# EAGLE design me433 (EAGLE 9.5.1)
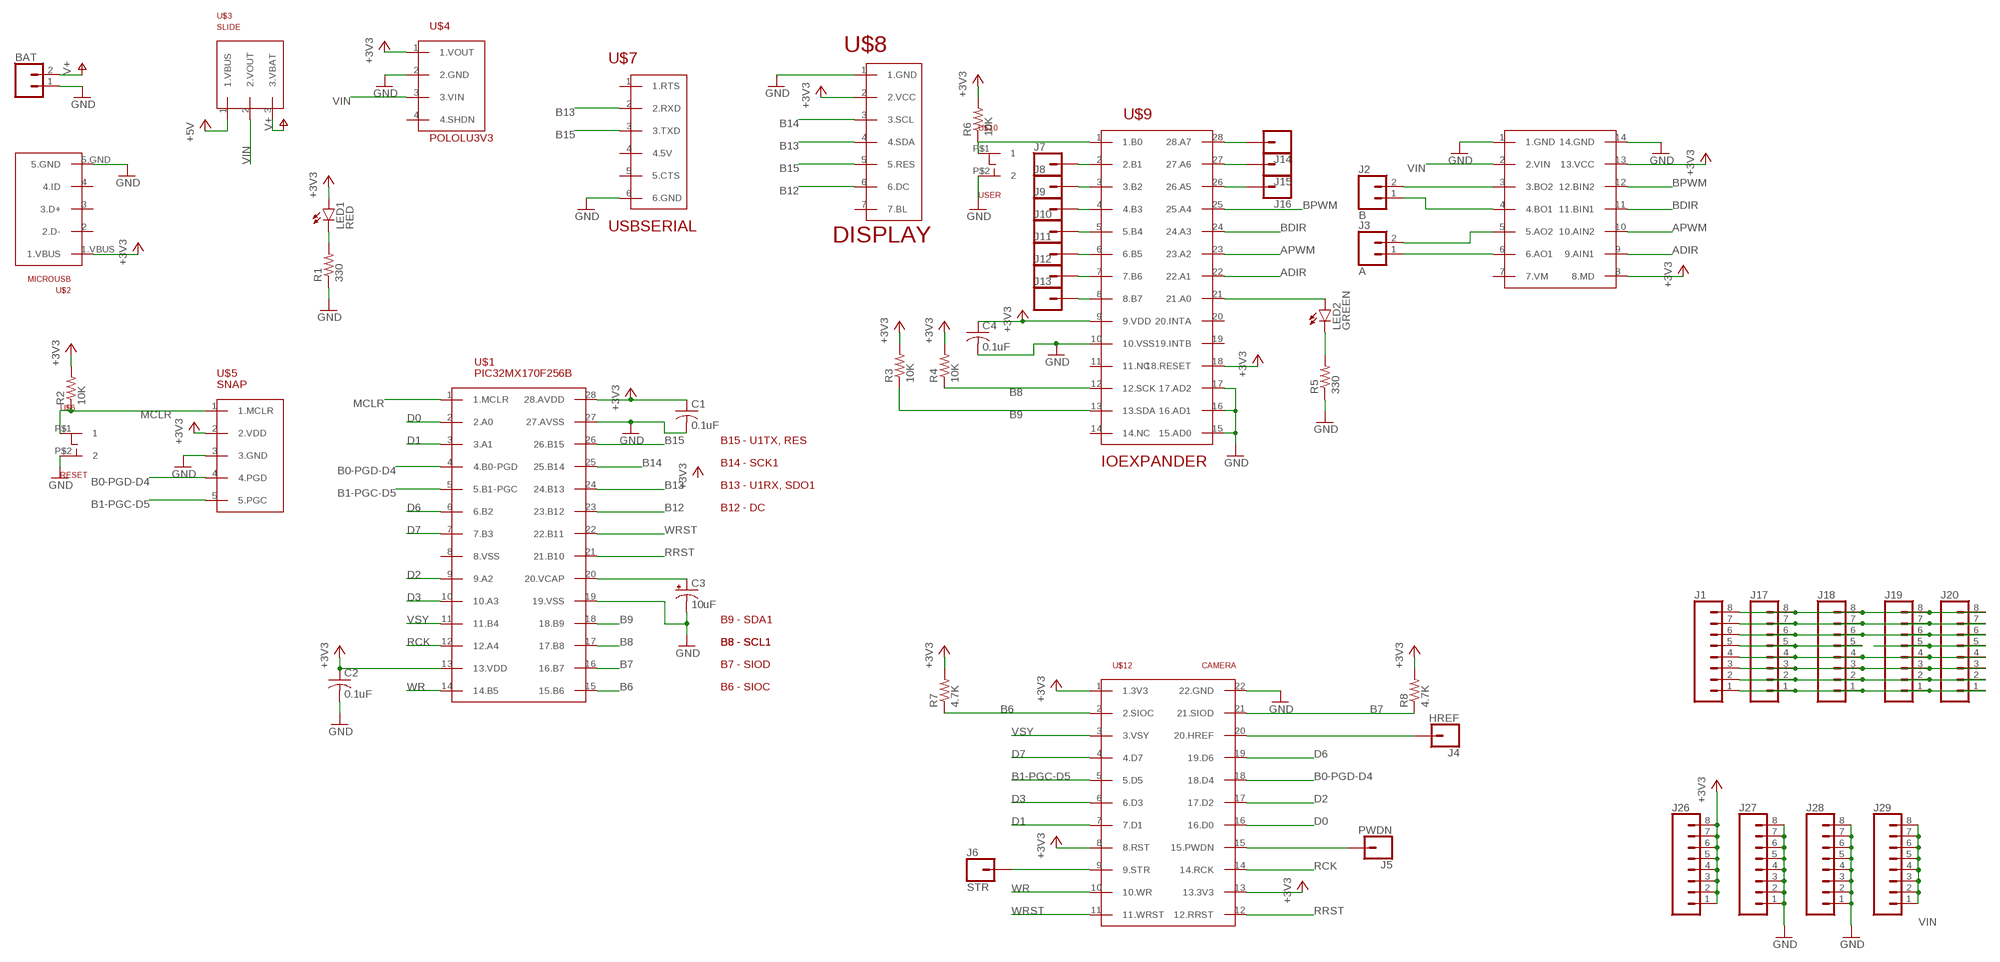
[diagram p0: schematic, sheet 1, part 1 of 2]
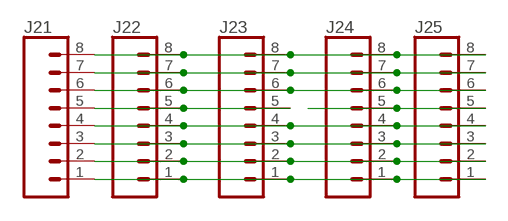
[diagram p1: schematic, sheet 1, part 2 of 2]

## Parts
BAT  CONN_02  [1X02]
C1  0.1uF  C-US025-030X050  [C025-030X050]
C2  0.1uF  C-US025-030X050  [C025-030X050]
C3  10uF  CPOL-USB45181B  [B45181B]
C4  0.1uF  C-US025-030X050  [C025-030X050]
J1  CONN_08"  [1X08]
J2  B  CONN_02  [1X02]
J3  A  CONN_02  [1X02]
J4  HREF  CONN_01  [1X01]
J5  PWDN  CONN_01  [1X01]
J6  STR  CONN_01  [1X01]
J7  CONN_01  [1X01]
J8  CONN_01  [1X01]
J9  CONN_01  [1X01]
J10  CONN_01  [1X01]
J11  CONN_01  [1X01]
J12  CONN_01  [1X01]
J13  CONN_01  [1X01]
J14  CONN_01  [1X01]
J15  CONN_01  [1X01]
J16  CONN_01  [1X01]
J17  CONN_08"  [1X08]
J18  CONN_08"  [1X08]
J19  CONN_08"  [1X08]
J20  CONN_08"  [1X08]
J21  CONN_08"  [1X08]
J22  CONN_08"  [1X08]
J23  CONN_08"  [1X08]
J24  CONN_08"  [1X08]
J25  CONN_08"  [1X08]
J26  CONN_08"  [1X08]
J27  CONN_08"  [1X08]
J28  CONN_08"  [1X08]
J29  CONN_08"  [1X08]
LED1  RED  LED3MM  [LED3MM]
LED2  GREEN  LED3MM  [LED3MM]
R1  330  R-US_0207/10  [0207/10]
R2  10K  R-US_0207/10  [0207/10]
R3  10K  R-US_0207/10  [0207/10]
R4  10K  R-US_0207/10  [0207/10]
R5  330  R-US_0207/10  [0207/10]
R6  10K  R-US_0207/10  [0207/10]
R7  4.7K  R-US_0207/10  [0207/10]
R8  4.7K  R-US_0207/10  [0207/10]
U$1  PIC32MX170F256B  [DIL28-3]
U$2  MICROUSB  [MICROUSB]
U$3  SLIDE  [SLIDE]
U$4  POLOLU3V3  [POLOLU3V3]
U$5  SNAP  [SNAP]
U$6  RESET  PUSH  [PUSH]
U$7  USBSERIAL  [USBSERIAL]
U$8  DISPLAY  [DISPLAY]
U$9  IOEXPANDER  [IOEXPANDER]
U$10  USER  PUSH  [PUSH]
U$11  HBRIDGE  [HBRIDGE]
U$12  CAMERA  [CAMERA]

## Nets
+3V1: LED2.A U$9.21(21.A0)
+3V3: C1.1 C2.1 C4.1 J26.1 J26.2 J26.3 J26.4 J26.5 J26.6 J26.7 J26.8 LED1.A R2.2 R3.2 R4.2 R6.2 R7.2 R8.2 U$1.13(13.VDD) U$1.28(28.AVDD) U$2.1.VBUS U$4.1(1.VOUT) U$5.2(2.VDD) U$8.2(2.VCC) U$9.9(9.VDD) U$9.18(18.RESET) U$11.8(8.MD) U$11.13(13.VCC) U$12.1(1.3V3) U$12.8(8.RST) U$12.13(13.3V3)
+5V: U$3.1(1.VBUS)
ADIR: U$9.22(22.A1) U$11.9(9.AIN1)
APWM: U$9.23(23.A2) U$11.10(10.AIN2)
B0-PGD-D4: U$1.4(4.B0-PGD) U$5.4(4.PGD) U$12.18(18.D4)
B1-PGC-D5: U$1.5(5.B1-PGC) U$5.5(5.PGC) U$12.5(5.D5)
B6: R7.1 U$1.15(15.B6) U$12.2(2.SIOC)
B7: R8.1 U$1.16(16.B7) U$12.21(21.SIOD)
B8: R4.1 U$1.17(17.B8) U$9.12(12.SCK)
B9: R3.1 U$1.18(18.B9) U$9.13(13.SDA)
B12: U$1.23(23.B12) U$8.6(6.DC)
B13: U$1.24(24.B13) U$7.2(2.RXD) U$8.4(4.SDA)
B14: U$1.25(25.B14) U$8.3(3.SCL)
B15: U$1.26(26.B15) U$7.3(3.TXD) U$8.5(5.RES)
BDIR: U$9.24(24.A3) U$11.11(11.BIN1)
BPWM: U$9.25(25.A4) U$11.12(12.BIN2)
D0: U$1.2(2.A0) U$12.16(16.D0)
D1: U$1.3(3.A1) U$12.7(7.D1)
D2: U$1.9(9.A2) U$12.17(17.D2)
D3: U$1.10(10.A3) U$12.6(6.D3)
D6: U$1.6(6.B2) U$12.19(19.D6)
D7: U$1.7(7.B3) U$12.4(4.D7)
GND: BAT.1 C1.2 C2.2 C3.- C4.2 J27.1 J27.2 J27.3 J27.4 J27.5 J27.6 J27.7 J27.8 J28.1 J28.2 J28.3 J28.4 J28.5 J28.6 J28.7 J28.8 R1.1 R5.1 U$1.19(19.VSS) U$1.27(27.AVSS) U$2.5.GND U$4.2(2.GND) U$5.3(3.GND) U$6.P$2 U$7.6(6.GND) U$8.1(1.GND) U$9.10(10.VSS) U$9.15(15.AD0) U$9.16(16.AD1) U$9.17(17.AD2) U$10.P$2 U$11.1(1.GND) U$11.14(14.GND) U$12.22(22.GND)
MCLR: R2.1 U$1.1(1.MCLR) U$5.1(1.MCLR) U$6.P$1
MCLR1: U$10.P$1
N$1: LED1.K(C) R1.2
N$2: C3.+ U$1.20(20.VCAP)
N$3: J2.2 U$11.3(3.BO2)
N$4: J2.1 U$11.4(4.BO1)
N$5: R6.1 U$9.1(1.B0)
N$6: LED2.K(C) R5.2
N$7: J3.2 U$11.5(5.AO2)
N$8: J3.1 U$11.6(6.AO1)
N$9: J4.1 U$12.20(20.HREF)
N$10: J5.1 U$12.15(15.PWDN)
N$11: J6.1 U$12.9(9.STR)
N$12: J14.1 U$9.28(28.A7)
N$13: J15.1 U$9.27(27.A6)
N$14: J16.1 U$9.26(26.A5)
N$15: J7.1 U$9.2(2.B1)
N$16: J8.1 U$9.3(3.B2)
N$17: J9.1 U$9.4(4.B3)
N$18: J10.1 U$9.5(5.B4)
N$19: J11.1 U$9.6(6.B5)
N$20: J12.1 U$9.7(7.B6)
N$21: J13.1 U$9.8(8.B7)
N$22: J1.8 J17.8 J18.8 J19.8 J20.8
N$23: J1.7 J17.7 J18.7 J19.7 J20.7
N$24: J1.6 J17.6 J18.6 J19.6 J20.6
N$25: J1.5 J17.5 J18.5
N$26: J19.5 J20.5
N$27: J1.4 J17.4 J18.4 J19.4 J20.4
N$28: J1.3 J17.3 J18.3 J19.3 J20.3
N$29: J1.2 J17.2 J18.2 J19.2 J20.2
N$30: J1.1 J17.1 J18.1 J19.1 J20.1
N$31: J21.8 J22.8 J23.8 J24.8 J25.8
N$32: J21.7 J22.7 J23.7 J24.7 J25.7
N$33: J21.6 J22.6 J23.6 J24.6 J25.6
N$34: J21.5 J22.5 J23.5
N$35: J24.5 J25.5
N$36: J21.4 J22.4 J23.4 J24.4 J25.4
N$37: J21.3 J22.3 J23.3 J24.3 J25.3
N$38: J21.2 J22.2 J23.2 J24.2 J25.2
N$39: J21.1 J22.1 J23.1 J24.1 J25.1
RCK: U$1.12(12.A4) U$12.14(14.RCK)
RRST: U$1.21(21.B10) U$12.12(12.RRST)
V+: BAT.2 U$3.3(3.VBAT)
VIN: J29.1 J29.2 J29.3 J29.4 J29.5 J29.6 J29.7 J29.8 U$3.2(2.VOUT) U$4.3(3.VIN) U$11.2(2.VIN)
VSY: U$1.11(11.B4) U$12.3(3.VSY)
WR: U$1.14(14.B5) U$12.10(10.WR)
WRST: U$1.22(22.B11) U$12.11(11.WRST)
Unconnected: U$1.8(8.VSS) U$2.2(2.D-) U$2.3(3.D+) U$2.4(4.ID) U$4.4(4.SHDN) U$7.1(1.RTS) U$7.4(4.5V) U$7.5(5.CTS) U$8.7(7.BL) U$9.11(11.NC) U$9.14(14.NC) U$9.19(19.INTB) U$9.20(20.INTA) U$11.7(7.VM)

## Notes on the sheet
- B15 - U1TX, RES
- B14 - SCK1
- B13 - U1RX, SDO1
- B12 - DC
- B9 - SDA1
- B8 - SCL1 | B8 - SCL1
- B7 - SIOD
- B6 - SIOC

## Library data of the parts
BAT J2 J3 = me433:CONN_02: Multi connection point. Often used as Generic Header-pin footprint for 0.1 inch spaced/style header connections On any of the 0.1 inch spaced packages, you can populate with these: Break Away Headers - Straight <https://www.sparkfun.com/products/116> (PRT-00116) Break Away Male Headers - Right Angle <https://www.sparkfun.com/products/553> (PRT-00553) Female Headers <https://www.sparkfun.com/products/115> (PRT-00115) Break Away Headers - Machine Pin <https://www.sparkfun.com/products/117> (PRT-00117) Break Away Female Headers - Swiss Machine Pin <https://www.sparkfun.com/products/743> (PRT-00743) For SCREWTERMINALS and SPRING TERMINALS visit here: Screw Terimnals on SparkFun.com <https://www.sparkfun.com/search/results?term=Screw+Terminals> (5mm/3.5mm/2.54mm spacing) This device is also useful as a general connection point to wire up your design to another part of your project. Our various solder wires solder well into these plated through hole pads. Hook-Up Wire - Assortment (Stranded, 22 AWG) <https://www.sparkfun.com/products/11375> (PRT-11375) Hook-Up Wire - Assortment (Solid Core, 22 AWG) <https://www.sparkfun.com/products/11367> (PRT-11367) View the entire wire category on our website here <https://www.sparkfun.com/categories/141> Special notes: Molex polarized connector foot print use with: PRT-08233 with associated crimp pins and housings. 2.54_SCREWTERM for use with PRT-10571. 3.5mm Screw Terminal footprints for PRT-08084 5mm Screw Terminal footprints for use with PRT-08432
C1 C2 C4 = me433:C-US: CAPACITOR, American symbol; SPICEPREFIX: C
C3 = me433:CPOL-US: POLARIZED CAPACITOR, American symbol; SPICEPREFIX: C
J1 J17-J29 = SparkFun-Connectors:CONN_08: Multi connection point. Often used as Generic Header-pin footprint for 0.1 inch spaced/style header connections On any of the 0.1 inch spaced packages, you can populate with these: Break Away Headers - Straight <https://www.sparkfun.com/products/116> (PRT-00116) Break Away Male Headers - Right Angle <https://www.sparkfun.com/products/553> (PRT-00553) Female Headers <https://www.sparkfun.com/products/115> (PRT-00115) Break Away Headers - Machine Pin <https://www.sparkfun.com/products/117> (PRT-00117) Break Away Female Headers - Swiss Machine Pin <https://www.sparkfun.com/products/743> (PRT-00743) Arduino Stackable Header - 8 Pin <https://www.sparkfun.com/products/9279> (PRT-09279) For SCREWTERMINALS and SPRING TERMINALS visit here: Screw Terimnals on SparkFun.com <https://www.sparkfun.com/search/results?term=Screw+Terminals> (5mm/3.5mm/2.54mm spacing) This device is also useful as a general connection point to wire up your design to another part of your project. Our various solder wires solder well into these plated through hole pads. Hook-Up Wire - Assortment (Stranded, 22 AWG) <https://www.sparkfun.com/products/11375> (PRT-11375) Hook-Up Wire - Assortment (Solid Core, 22 AWG) <https://www.sparkfun.com/products/11367> (PRT-11367) View the entire wire category on our website here <https://www.sparkfun.com/categories/141> Special notes: Molex polarized connector foot print use with SKU : PRT-08231 with associated crimp pins and housings. 1MM SMD Version SKU: PRT-10208 NOTES ON THE VARIANTS LOCK and LOCK_LONGPADS... This footprint was designed to help hold the alignment of a through-hole component (i.e. 6-pin header) while soldering it into place. You may notice that each hole has been shifted either up or down by 0.005 of an inch from it's more standard position (which is a perfectly straight line). This slight alteration caused the pins (the squares in the middle) to touch the edges of the holes. Because they are alternating, it causes a "brace" to hold the component in place. 0.005 has proven to be the perfect amount of "off-center" position when using our standard breakaway headers. Although looks a little odd when you look at the bare footprint, once you have a header in there, the alteration is very hard to notice. Also,if you push a header all the way into place, it is covered up entirely on the bottom side.; PROD_ID: CONN-08438
J4-J16 = me433:CONN_01: Single connection point. Often used as Generic Header-pin footprint for 0.1 inch spaced/style header connections On any of the 0.1 inch spaced packages, you can populate with these: Break Away Headers - Straight <https://www.sparkfun.com/products/116> (PRT-00116) Break Away Male Headers - Right Angle <https://www.sparkfun.com/products/553> (PRT-00553) Female Headers <https://www.sparkfun.com/products/115> (PRT-00115) Break Away Headers - Machine Pin <https://www.sparkfun.com/products/117> (PRT-00117) Break Away Female Headers - Swiss Machine Pin <https://www.sparkfun.com/products/743> (PRT-00743) This device is also useful as a general connection point to wire up your design to another part of your project. Our various solder wires solder well into these plated through hole pads. Hook-Up Wire - Assortment (Stranded, 22 AWG) <https://www.sparkfun.com/products/11375> (PRT-11375) Hook-Up Wire - Assortment (Solid Core, 22 AWG) <https://www.sparkfun.com/products/11367> (PRT-11367) View the entire wire category on our website here <https://www.sparkfun.com/categories/141> Special notes: SMTSO-256-ET is a "flush mount" nut for a 4-40 screw. We mostly use this on specialty testbeds; it is a nice way to connect hardware to your PCB at an adjustable hieght. Also note, the SNAP packages are for using a snappable style connector. We sell a baggie of snaps and they are also used on two LilyPad designs: Snap Assortment - 30 pack (male and female) <https://www.sparkfun.com/products/11347> (DEV-11347) LilyPad Arduino SimpleSnap <https://www.sparkfun.com/products/10941> (DEV-10941) LilyPad SimpleSnap Protoboard <https://www.sparkfun.com/products/10940> (DEV-10940)
LED1 LED2 = me433:LED: LED OSRAM: - CHIPLED LG R971, LG N971, LY N971, LG Q971, LY Q971, LO R971, LY R971 LH N974, LH R974 LS Q976, LO Q976, LY Q976 LO Q996 - Hyper CHIPLED LW Q18S LB Q993, LB Q99A, LB R99A - SideLED LS A670, LO A670, LY A670, LG A670, LP A670 LB A673, LV A673, LT A673, LW A673 LH A674 LY A675 LS A676, LA A676, LO A676, LY A676, LW A676 LS A679, LY A679, LG A679 - Hyper Micro SIDELED® LS Y876, LA Y876, LO Y876, LY Y876 LT Y87S - SmartLED LW L88C, LW L88S LB L89C, LB L89S, LG L890 LS L89K, LO L89K, LY L89K LS L896, LA L896, LO L896, LY L896 - TOPLED LS T670, LO T670, LY T670, LG T670, LP T670 LSG T670, LSP T670, LSY T670, LOP T670, LYG T670 LG T671, LOG T671, LSG T671 LB T673, LV T673, LT T673, LW T673 LH T674 LS T676, LA T676, LO T676, LY T676, LB T676, LH T676, LSB T676, LW T676 LB T67C, LV T67C, LT T67C, LS T67K, LO T67K, LY T67K, LW E67C LS E67B, LA E67B, LO E67B, LY E67B, LB E67C, LV E67C, LT E67C LW T67C LS T679, LY T679, LG T679 LS T770, LO T770, LY T770, LG T770, LP T770 LB T773, LV T773, LT T773, LW T773 LH T774 LS E675, LA E675, LY E675, LS T675 LS T776, LA T776, LO T776, LY T776, LB T776 LHGB T686 LT T68C, LB T68C - Hyper Mini TOPLED® LB M676 - Mini TOPLED Santana® LG M470 LS M47K, LO M47K, LY M47K Source: http://www.osram.convergy.de LUXEON: - LUMILED® LXK2-PW12-R00, LXK2-PW12-S00, LXK2-PW14-U00, LXK2-PW14-V00 LXK2-PM12-R00, LXK2-PM12-S00, LXK2-PM14-U00 LXK2-PE12-Q00, LXK2-PE12-R00, LXK2-PE12-S00, LXK2-PE14-T00, LXK2-PE14-U00 LXK2-PB12-K00, LXK2-PB12-L00, LXK2-PB12-M00, LXK2-PB14-N00, LXK2-PB14-P00, LXK2-PB14-Q00 LXK2-PR12-L00, LXK2-PR12-M00, LXK2-PR14-Q00, LXK2-PR14-R00 LXK2-PD12-Q00, LXK2-PD12-R00, LXK2-PD12-S00 LXK2-PH12-R00, LXK2-PH12-S00 LXK2-PL12-P00, LXK2-PL12-Q00, LXK2-PL12-R00 Source: www.luxeon.com KINGBRIGHT: KA-3528ASYC Source: www.kingbright.com
R1-R8 = me433:R-US_: RESISTOR, American symbol; SPICEPREFIX: R
U$1 = me433:PIC32MX170F256B
U$2 = me433:MICROUSB
U$3 = me433:SLIDE
U$4 = me433:POLOLU3V3
U$5 = me433:SNAP
U$6 U$10 = me433:PUSH
U$7 = me433:USBSERIAL
U$8 = me433:DISPLAY
U$9 = me433:IOEXPANDER
U$11 = me433:HBRIDGE
U$12 = me433:CAMERA

## Board
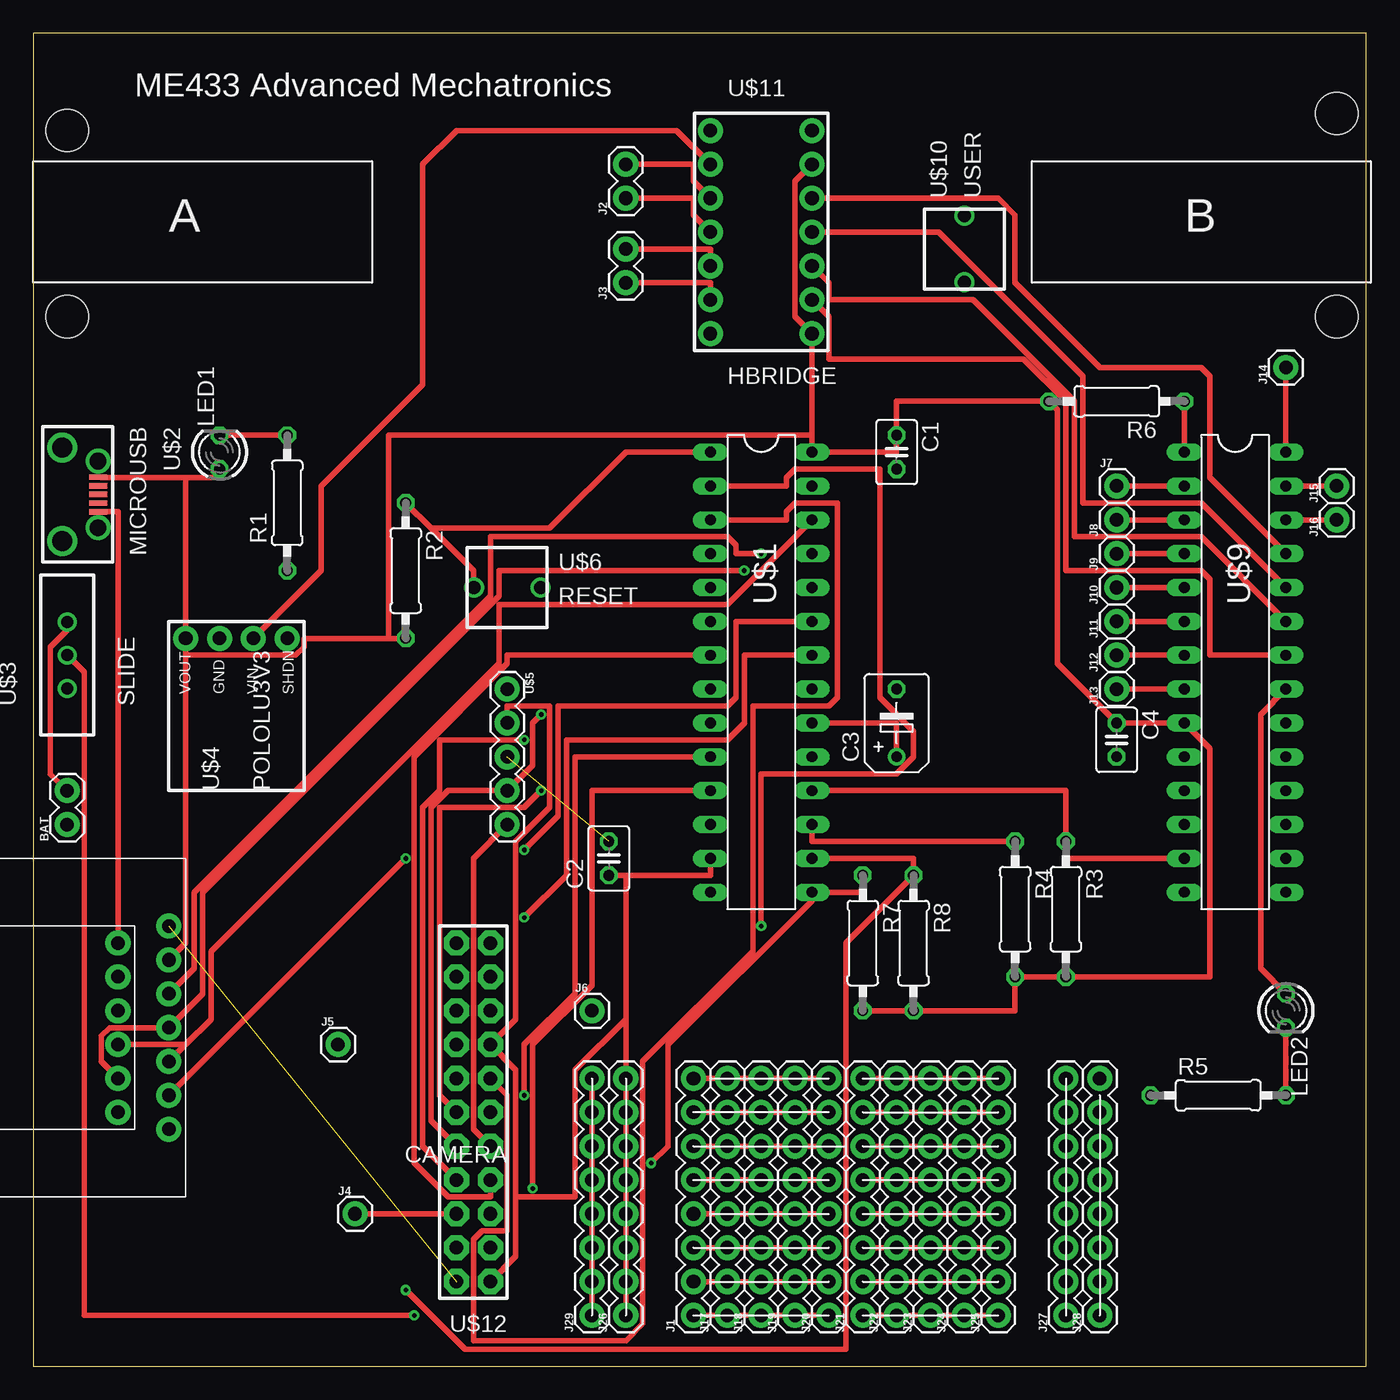
[diagram p2: board, top side]
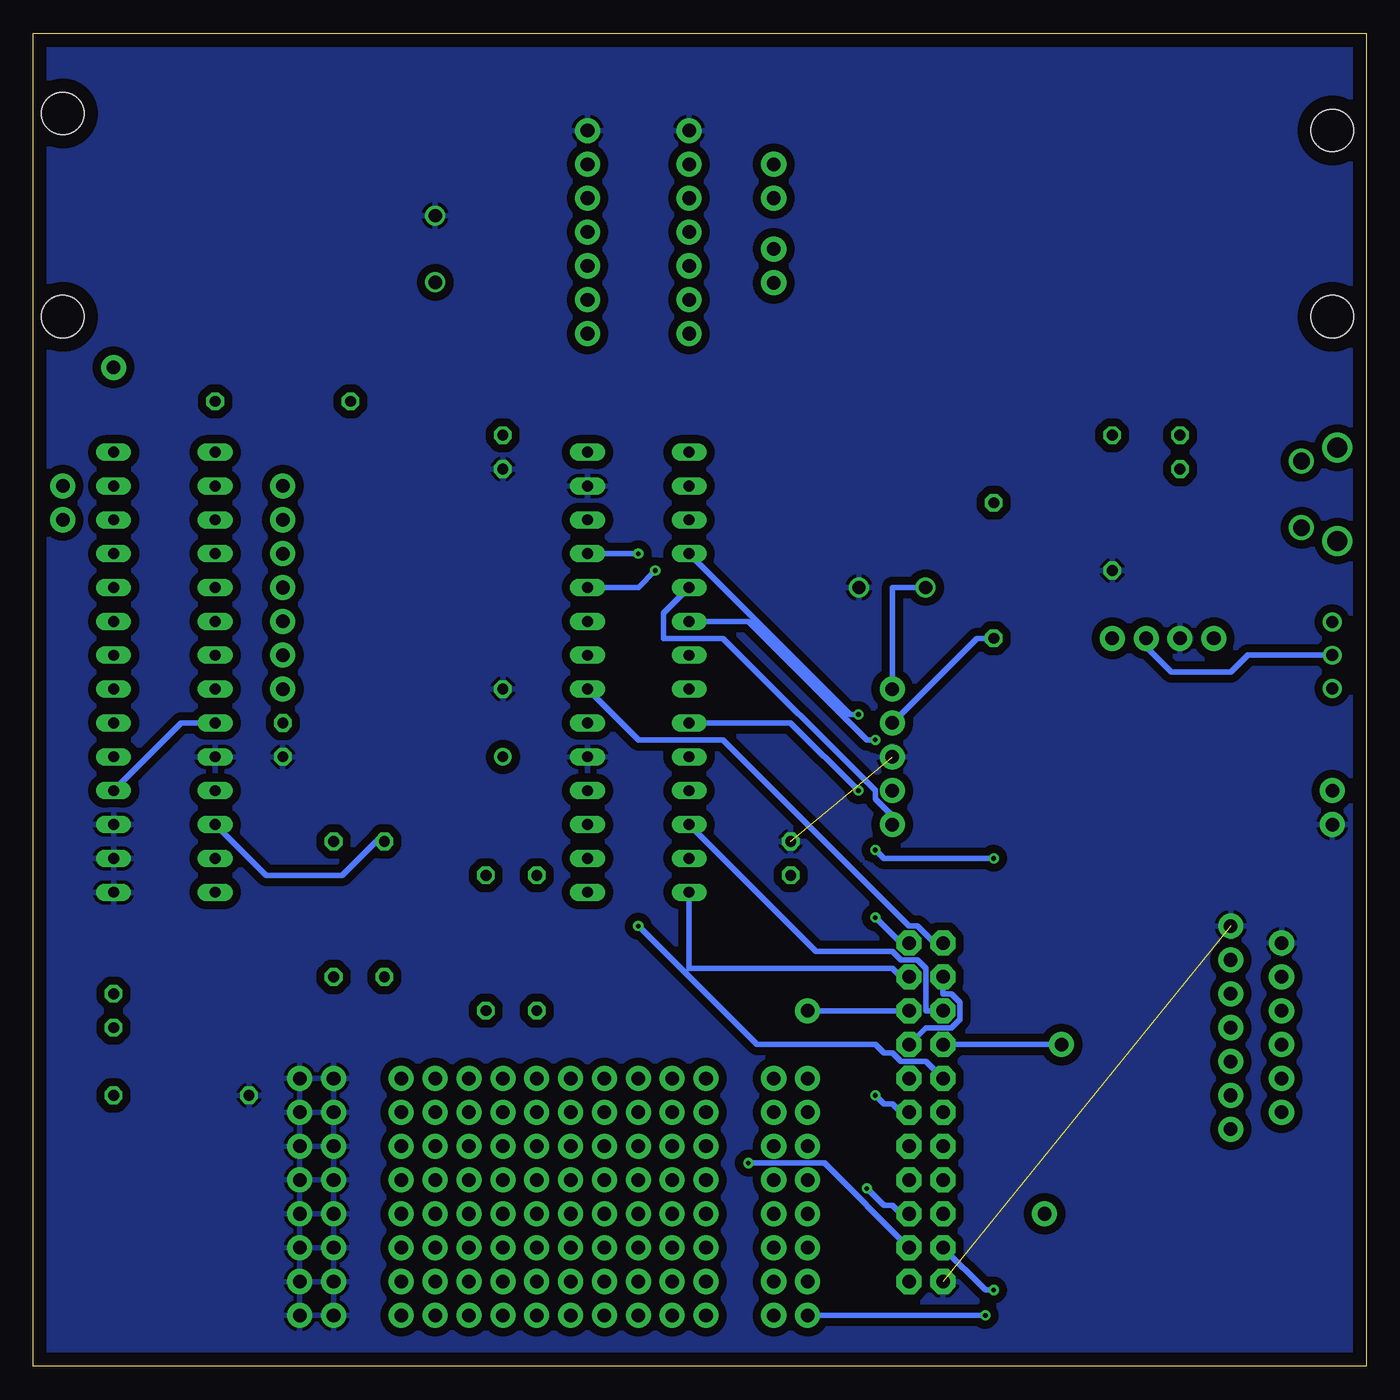
[diagram p3: board, bottom side, seen from below]

Size 100 x 100 mm. Coordinates in mm from the lower left corner, seen from the top.
Outline: 0,0 100,0 100,100 0,100 0,0
Copper layers (1*16): Top 0.035mm / dielectric 1.5mm / Bottom 0.035mm
Design rules "default": minimum track width 6mil, minimum drill 0.35mm, track to track 6mil, track to pad 6mil, pad to pad 6mil, via to via 6mil, smd to smd 6mil, copper to edge 40mil, drill to drill 6mil, minimum pad ring 10mil, minimum via ring 8mil, stop-mask expansion 4mil, vias tented up to drill 0mil, thermal gap 10mil
Holes 3.17 mm at 2.54,92.71 2.54,78.74 97.79,93.98 97.79,78.74

### Footprints (pad centres in the part's own frame; a part is rotated, then mirrored left to right if it is on the bottom)
1X02 = drill 1.016 pad 1.88: 1 0,0; 2 2.54,0
C025-030X050 = drill 0.813 octagon: 1 -1.27,0; 2 1.27,0
B45181B = drill 0.813: + -2.54,0 | drill 0.813 octagon: - 2.54,0
1X08 = drill 1.016 pad 1.88: 1 0,0; 2 2.54,0; 3 5.08,0; 4 7.62,0; 5 10.16,0; 6 12.7,0; 7 15.24,0; 8 17.78,0
1X01 = drill 1.016 pad 1.88: 1 0,0
LED3MM = drill 0.813 octagon: A -1.27,0; K 1.27,0
0207/10 = drill 0.813 octagon: 1 -5.08,0; 2 5.08,0
DIL28-3 = drill 0.813 long: 1 -16.51,-3.81; 2 -13.97,-3.81; 3 -11.43,-3.81; 4 -8.89,-3.81; 5 -6.35,-3.81; 6 -3.81,-3.81; 7 -1.27,-3.81; 8 1.27,-3.81; 9 3.81,-3.81; 10 6.35,-3.81; 11 8.89,-3.81; 12 11.43,-3.81; 13 13.97,-3.81; 14 16.51,-3.81; 15 16.51,3.81; 16 13.97,3.81; 17 11.43,3.81; 18 8.89,3.81; 19 6.35,3.81; 20 3.81,3.81; 21 1.27,3.81; 22 -1.27,3.81; 23 -3.81,3.81; 24 -6.35,3.81; 25 -8.89,3.81; 26 -11.43,3.81; 27 -13.97,3.81; 28 -16.51,3.81
MICROUSB = smd 0.4 x 1.35: 1.VBUS -1.3,2.7; 2 -0.65,2.7; 3 0,2.7; 4 0.65,2.7; 5.GND 1.3,2.7 | drill 1.25 pad 1.676: P$6 -2.5,2.7; P$7 2.5,2.7 | drill 1.5: P$8 -3.5,0; P$9 3.5,0
SLIDE = drill 0.9: 1 -2.5,0; 2 0,0; 3 2.5,0
POLOLU3V3 = drill 1.016 pad 1.88: 1 0,3.81; 2 0,1.27; 3 0,-1.27; 4 0,-3.81
SNAP = drill 1.016 pad 1.88: 1 0,5.08; 2 0,2.54; 3 0,0; 4 0,-2.54; 5 0,-5.08
PUSH = drill 1: P$1 -2.5,0; P$2 2.5,0
USBSERIAL = drill 1.016 pad 1.88: 1 0,6.35; 2 0,3.81; 3 0,1.27; 4 0,-1.27; 5 0,-3.81; 6 0,-6.35
DISPLAY = drill 1.016 pad 1.88: 1 -1.27,7.62; 2 -1.27,5.08; 3 -1.27,2.54; 4 -1.27,0; 5 -1.27,-2.54; 6 -1.27,-5.08; 7 -1.27,-7.62
IOEXPANDER = drill 0.813 long: 1 -16.51,-3.81; 2 -13.97,-3.81; 3 -11.43,-3.81; 4 -8.89,-3.81; 5 -6.35,-3.81; 6 -3.81,-3.81; 7 -1.27,-3.81; 8 1.27,-3.81; 9 3.81,-3.81; 10 6.35,-3.81; 11 8.89,-3.81; 12 11.43,-3.81; 13 13.97,-3.81; 14 16.51,-3.81; 15 16.51,3.81; 16 13.97,3.81; 17 11.43,3.81; 18 8.89,3.81; 19 6.35,3.81; 20 3.81,3.81; 21 1.27,3.81; 22 -1.27,3.81; 23 -3.81,3.81; 24 -6.35,3.81; 25 -8.89,3.81; 26 -11.43,3.81; 27 -13.97,3.81; 28 -16.51,3.81
HBRIDGE = drill 1.016 pad 1.88: 1 -3.81,7.62; 2 -3.81,5.08; 3 -3.81,2.54; 4 -3.81,0; 5 -3.81,-2.54; 6 -3.81,-5.08; 7 -3.81,-7.62; 8 3.81,-7.62; 9 3.81,-5.08; 10 3.81,-2.54; 11 3.81,0; 12 3.81,2.54; 13 3.81,5.08; 14 3.81,7.62
CAMERA = drill 1.016 pad 1.88 octagon: 1 -1.27,12.7; 2 -1.27,10.16; 3 -1.27,7.62; 4 -1.27,5.08; 5 -1.27,2.54; 6 -1.27,0; 7 -1.27,-2.54; 8 -1.27,-5.08; 9 -1.27,-7.62; 10 -1.27,-10.16; 11 -1.27,-12.7; 12 1.27,-12.7; 13 1.27,-10.16; 14 1.27,-7.62; 15 1.27,-5.08; 16 1.27,-2.54; 17 1.27,0; 18 1.27,2.54; 19 1.27,5.08; 20 1.27,7.62; 21 1.27,10.16; 22 1.27,12.7

### Placement (x,y rotation side)
BAT  2.54,40.64 90 top
C1  64.77,68.58 270 top
C2  43.18,38.1 90 top
C3  64.77,48.26 90 top
C4  81.28,46.99 270 top
J1  49.53,3.81 90 top
J2  44.45,87.63 90 top
J3  44.45,81.28 90 top
J4  24.13,11.43 0 top
J5  22.86,24.13 0 top
J6  41.91,26.67 0 top
J7  81.28,66.04 0 top
J8  81.28,63.5 90 top
J9  81.28,60.96 90 top
J10  81.28,58.42 90 top
J11  81.28,55.88 90 top
J12  81.28,53.34 90 top
J13  81.28,50.8 90 top
J14  93.98,74.93 90 top
J15  97.79,66.04 90 top
J16  97.79,63.5 90 top
J17  52.07,3.81 90 top
J18  54.61,3.81 90 top
J19  57.15,3.81 90 top
J20  59.69,3.81 90 top
J21  62.23,3.81 90 top
J22  64.77,3.81 90 top
J23  67.31,3.81 90 top
J24  69.85,3.81 90 top
J25  72.39,3.81 90 top
J26  44.45,3.81 90 top
J27  77.47,3.81 90 top
J28  80.01,3.81 90 top
J29  41.91,3.81 90 top
LED1  13.97,68.58 90 top
LED2  93.98,26.67 270 top
R1  19.05,64.77 90 top
R2  27.94,59.69 270 top
R3  77.47,34.29 270 top
R4  73.66,34.29 270 top
R5  88.9,20.32 0 top
R6  81.28,72.39 180 top
R7  62.23,31.75 270 top
R8  66.04,31.75 270 top
U$1  54.61,52.07 270 top
U$2  2.16,65.41 270 top
U$3  2.54,53.34 90 top
U$4  15.24,54.61 90 top
U$5  35.56,45.72 0 top
U$6  35.56,58.42 0 top
U$7  6.35,25.4 180 top
U$8  11.43,25.4 0 top
U$9  90.17,52.07 270 top
U$10  69.85,83.82 90 top
U$11  54.61,85.09 0 top
U$12  33.02,19.05 180 top

### Tracks (layer width: path | path; a pad name or v marks a point on that pad's centre or on a via)
+3V1
  Top 0.406: LED2.A 92.08,29.84 92.08,48.9 U$9.21
+3V3
  Top 0.406: 58.42,69.85 U$1.28 64.77,68.58 C1.1 64.77,72.39 R6.2 76.83,71.75 76.83,52.7 C4.1 U$9.9 88.27,46.35 88.27,29.21 R3.2 R4.2 73.66,26.67 R8.2 R7.2 | 58.42,69.85 U$11.8 57.15,78.74 57.15,88.9 U$11.13 | U$12.1 36.2,8.26 36.2,12.7 | 36.2,12.7 36.2,22.23 U$12.8 36.2,26.04 36.2,39.37 38.73,41.91 38.73,49.53 35.56,49.53 U$5.2 | 44.45,36.83 50.8,36.83 U$1.13 | 44.45,36.83 C2.1 | J26.1 J26.2 J26.3 J26.4 J26.5 J26.6 J26.7 J26.8 44.45,26.04 | 44.45,26.04 44.45,36.83 | 36.2,12.7 40.64,12.7 40.64,22.23 44.45,26.04 | 11.43,66.67 13.97,66.67 LED1.A | 11.43,66.67 5.08,66.67 U$2.1.VBUS | 26.67,54.61 20.32,54.61 20.32,53.98 19.68,53.34 11.43,53.34 | 26.67,54.61 R2.2 | 11.43,53.34 U$4.1 11.43,66.67 | U$8.2 11.43,31.75 11.43,53.34 | 58.42,69.85 26.67,69.85 26.67,54.61
  Bottom 0.406: U$9.18 88.9,48.26 U$9.9 | U$12.13 31.75,27.94 31.11,27.94 30.48,27.3 30.48,26.04 31.11,25.4 33.02,25.4 U$12.8 | U$5.2 29.21,54.61 R2.2
ADIR
  Top 0.406: U$9.22 88.27,53.34 88.27,59.05 87.63,59.69 77.47,59.69 77.47,72.39 74.3,75.56 59.69,75.56 59.69,78.74 U$11.9
APWM
  Top 0.406: U$9.23 87.63,62.23 78.11,62.23 78.11,72.39 70.48,80.01 59.69,80.01 59.69,81.28 U$11.10
B0-PGD-D4  (via drill 0.35)
  Top 0.406: v38.1,48.9 37.47,48.26 37.47,45.09 U$5.4 31.11,43.18 29.84,41.91 29.84,18.41 U$12.18
  Bottom 0.406: U$1.4 38.73,48.9 v38.1,48.9
B1-PGC-D5
  Top 0.406: U$12.5 33.02,17.78 33.02,38.1 U$5.5
  Bottom 0.406: U$1.5 52.7,56.52 52.7,54.61 48.26,54.61 36.83,43.18 36.83,42.55 35.56,41.27 U$5.5
B6  (via drill 0.35)
  Top 0.406: R7.1 62.23,35.56 U$1.15 58.42,34.92 47.62,24.13 47.62,16.51 v46.35,15.24
  Bottom 0.406: U$12.2 40.64,15.24 v46.35,15.24
B7  (via drill 0.35)
  Top 0.406: U$1.16 66.04,38.1 R8.1 60.96,31.75 60.96,1.27 32.38,1.27 v27.94,5.71
  Bottom 0.406: U$12.21 28.57,5.71 v27.94,5.71
B8
  Top 0.406: R4.1 58.42,39.37 U$1.17
  Bottom 0.406: U$9.12 82.55,36.83 76.83,36.83 74.3,39.37 R4.1
B9
  Top 0.406: U$1.18 77.47,43.18 R3.1 77.47,38.1 U$9.13
B12  (via drill 0.35)
  Top 0.406: U$1.23 52.7,55.88 52.7,50.16 52.07,49.53 39.37,49.53 39.37,41.27 v36.83,38.73 | U$8.6 v27.94,38.1
  Bottom 0.406: v36.83,38.73 36.2,38.1 v27.94,38.1
B13  (via drill 0.35)
  Top 0.406: v53.34,59.69 34.92,59.69 34.92,57.78 12.7,35.56 12.7,27.94 U$8.4 5.71,25.4 5.08,24.77 5.08,22.86 U$7.2
  Bottom 0.406: U$1.24 54.61,58.42 v53.34,59.69
B14  (via drill 0.35)
  Top 0.406: v54.61,60.96 52.7,60.96 52.7,61.59 52.07,62.23 34.29,62.23 34.29,57.78 12.06,35.56 12.06,29.84 U$8.3
  Bottom 0.406: v54.61,60.96 U$1.25
B15
  Top 0.406: U$1.26 52.07,57.15 34.92,57.15 34.92,52.7 13.34,31.11 13.34,26.04 11.43,24.13 | U$8.5 11.43,24.13 | 11.43,24.13 U$7.3
BDIR
  Top 0.406: U$9.24 87.63,64.77 78.74,64.77 78.74,74.3 67.94,85.09 U$11.11
BPWM
  Top 0.406: U$9.25 88.27,66.67 88.27,74.3 87.63,74.93 80.01,74.93 73.66,81.28 73.66,86.36 72.39,87.63 U$11.12
D0  (via drill 0.35)
  Top 0.406: U$1.2 56.52,66.04 56.52,66.67 57.15,67.31 63.5,67.31 63.5,50.16 66.04,47.62 66.04,45.72 64.77,44.45 54.61,44.45 v54.61,33.02
  Bottom 0.406: v54.61,33.02 45.72,24.13 36.83,24.13 36.2,23.5 35.56,23.5 34.92,22.86 33.02,22.86 U$12.16
D1
  Top 0.406: U$1.3 56.52,63.5 56.52,64.14 57.15,64.77 60.33,64.77 60.33,50.16 59.69,49.53 53.98,49.53 53.98,31.11 45.72,22.86 45.72,3.17 44.45,1.91 33.02,1.91 33.02,9.53 33.66,10.16 35.56,10.16 35.56,20.32 U$12.7
D2  (via drill 0.35)
  Top 0.406: v38.1,43.18 36.83,41.91 30.48,41.91 30.48,20.32 U$12.17
  Bottom 0.406: U$1.9 43.18,48.26 v38.1,43.18
D3  (via drill 0.35)
  Top 0.406: U$1.10 40.64,45.72 40.64,27.94 36.83,24.13 v36.83,20.32
  Bottom 0.406: v36.83,20.32 36.2,19.68 35.56,19.68 34.92,19.05 U$12.6
D6  (via drill 0.35)
  Top 0.406: v36.83,46.99 30.48,46.99 30.48,43.18 29.21,41.91 29.21,16.51 U$12.19
  Bottom 0.406: U$1.6 46.35,55.88 37.47,46.99 v36.83,46.99
D7
  Top 0.406: U$1.7 35.56,53.34 35.56,52.7 28.57,45.72 28.57,15.24 31.11,12.7 34.29,12.7 U$12.4
GND  (2 unrouted)
  Top 0.406: U$7.6 6.35,64.14 5.08,64.14 U$2.5.GND
  Bottom 0.152: 80.01,19.68 J28.7 | J28.8 79.96,21.54
  pour Bottom (isolate 0.61): 0,100.33 0,0 100.33,0 100.33,100.33
MCLR
  Top 0.406: 29.84,62.87 33.02,59.69 33.02,58.42 U$6.P$1 | 29.84,62.87 R2.1 | U$1.1 44.45,68.58 38.73,62.87 29.84,62.87
  Bottom 0.406: U$5.1 35.56,58.42 U$6.P$1
N$1
  Top 0.406: R1.2 LED1.K
N$2
  Top 0.406: U$1.20 64.77,48.26 C3.+
N$3
  Top 0.406: J2.2 49.53,90.17 49.53,88.9 U$11.3
N$4
  Top 0.406: J2.1 49.53,87.63 49.53,86.36 U$11.4
N$5
  Top 0.406: R6.1 U$9.1
N$6
  Top 0.406: LED2.K R5.2
N$7
  Top 0.406: J3.2 50.8,83.82 U$11.5
N$8
  Top 0.406: J3.1 50.8,81.28 U$11.6
N$9
  Top 0.406: U$12.20 J4.1
N$10
  Bottom 0.406: U$12.15 J5.1
N$11
  Bottom 0.406: J6.1 U$12.9
N$12
  Top 0.406: J14.1 U$9.28
N$13
  Top 0.406: J15.1 U$9.27
N$14
  Top 0.406: J16.1 U$9.26
N$15
  Top 0.406: J7.1 U$9.2
N$16
  Top 0.406: J8.1 U$9.3
N$17
  Top 0.406: J9.1 U$9.4
N$18
  Top 0.406: J10.1 U$9.5
N$19
  Top 0.406: J11.1 U$9.6
N$20
  Top 0.406: J12.1 U$9.7
N$21
  Top 0.406: J13.1 U$9.8
N$22
  Top 0.406: J1.8 J17.8 J18.8 J19.8 J20.8
N$23
  Top 0.406: J1.7 J17.7 J18.7 J19.7 J20.7
N$24
  Top 0.406: J1.6 J17.6 J18.6 J19.6 J20.6
N$25
  Top 0.406: J1.5 J17.5 J18.5
N$26
  Top 0.406: J20.5 J19.5
N$27
  Top 0.406: J1.4 J17.4 J18.4 J19.4 J20.4
N$28
  Top 0.406: J1.3 J17.3 J18.3 J19.3 J20.3
N$29
  Top 0.406: J1.2 J17.2 J18.2 J19.2 J20.2
N$30
  Top 0.406: J1.1 J17.1 J18.1 J19.1 J20.1
N$31
  Top 0.406: J21.8 J22.8 J23.8 J24.8 J25.8
N$32
  Top 0.406: J21.7 J22.7 J23.7 J24.7 J25.7
N$33
  Top 0.406: J21.6 J22.6 J23.6 J24.6 J25.6
N$34
  Top 0.406: J21.5 J22.5 J23.5
N$35
  Top 0.406: J25.5 J24.5
N$36
  Top 0.406: J21.4 J22.4 J23.4 J24.4 J25.4
N$37
  Top 0.406: J21.3 J22.3 J23.3 J24.3 J25.3
N$38
  Top 0.406: J21.2 J22.2 J23.2 J24.2 J25.2
N$39
  Top 0.406: J21.1 J22.1 J23.1 J24.1 J25.1
RCK
  Bottom 0.406: U$1.12 41.27,31.11 35.56,31.11 34.92,30.48 33.66,30.48 33.02,29.84 33.02,26.67 U$12.14
RRST
  Bottom 0.406: U$1.21 54.61,46.99 48.26,46.99 34.29,33.02 33.66,33.02 32.38,31.75 U$12.12
V+
  Top 0.406: BAT.2 1.27,44.45 1.27,53.98 2.54,55.24 U$3.3
VIN  (via drill 0.35)
  Top 0.406: J29.8 J29.7 J29.6 J29.5 J29.4 J29.3 J29.2 J29.1 | v28.57,3.81 3.81,3.81 3.81,52.07 U$3.2 | U$11.2 48.26,92.71 31.75,92.71 29.21,90.17 29.21,73.66 21.59,66.04 21.59,59.69 U$4.3
  Bottom 0.406: U$3.2 8.89,53.34 10.16,52.07 14.61,52.07 16.51,53.98 U$4.3 | v28.57,3.81 J29.1
VSY  (via drill 0.35)
  Top 0.406: U$1.11 41.91,43.18 41.91,28.57 37.47,24.13 v37.47,13.34
  Bottom 0.406: v37.47,13.34 36.2,12.06 35.56,12.06 34.92,11.43 U$12.3
WR
  Bottom 0.406: U$1.14 50.8,29.84 35.56,29.84 34.92,29.21 U$12.10
WRST  (via drill 0.35)
  Top 0.406: U$1.22 53.34,53.34 53.34,48.26 52.07,46.99 40.01,46.99 40.01,36.83 v36.83,33.66
  Bottom 0.406: v36.83,33.66 34.92,31.75 U$12.11

### Text on the board
tPlace: ME433 Advanced Mechatronics | A | B